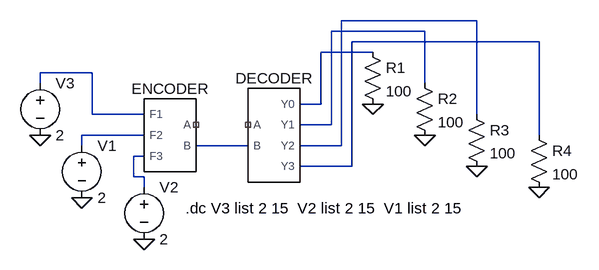
[diagram p0: schematic EXP5-2_UtsavPathak.asc]
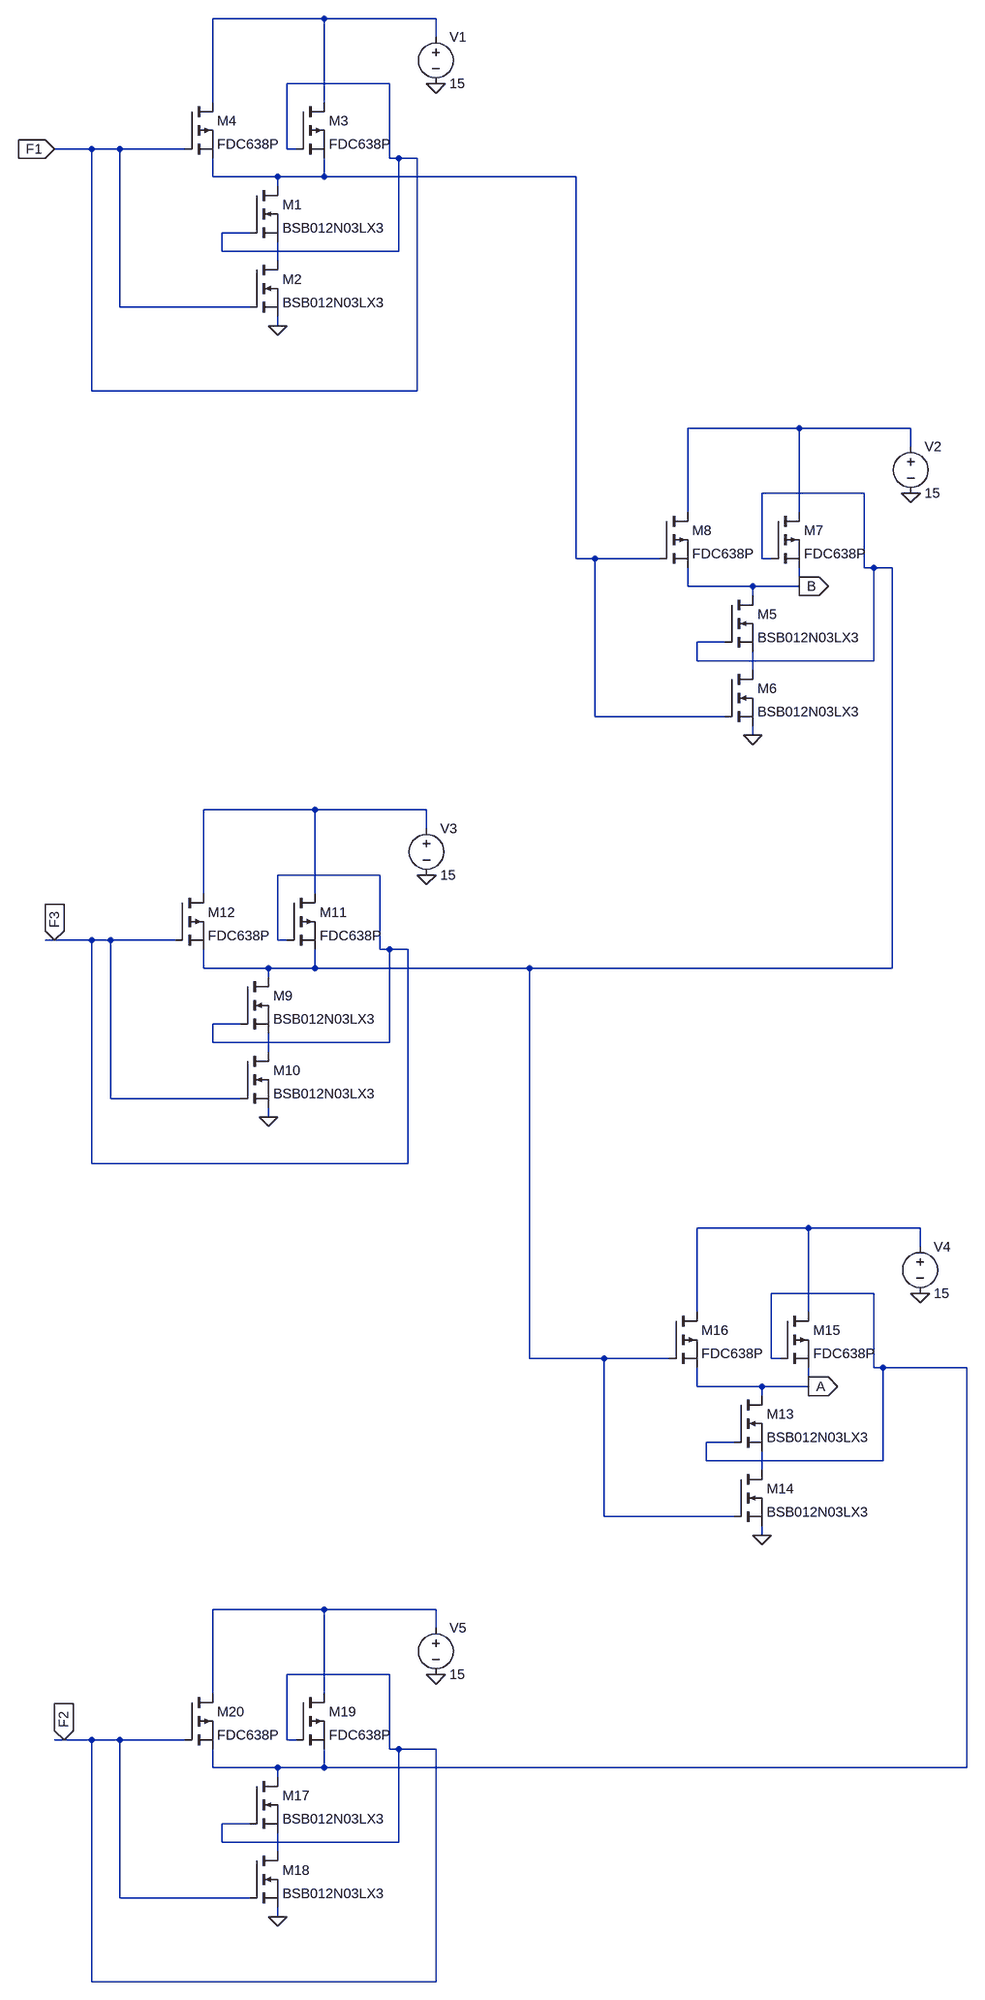
[diagram p1: sub-circuit encoder_exp5.asc]
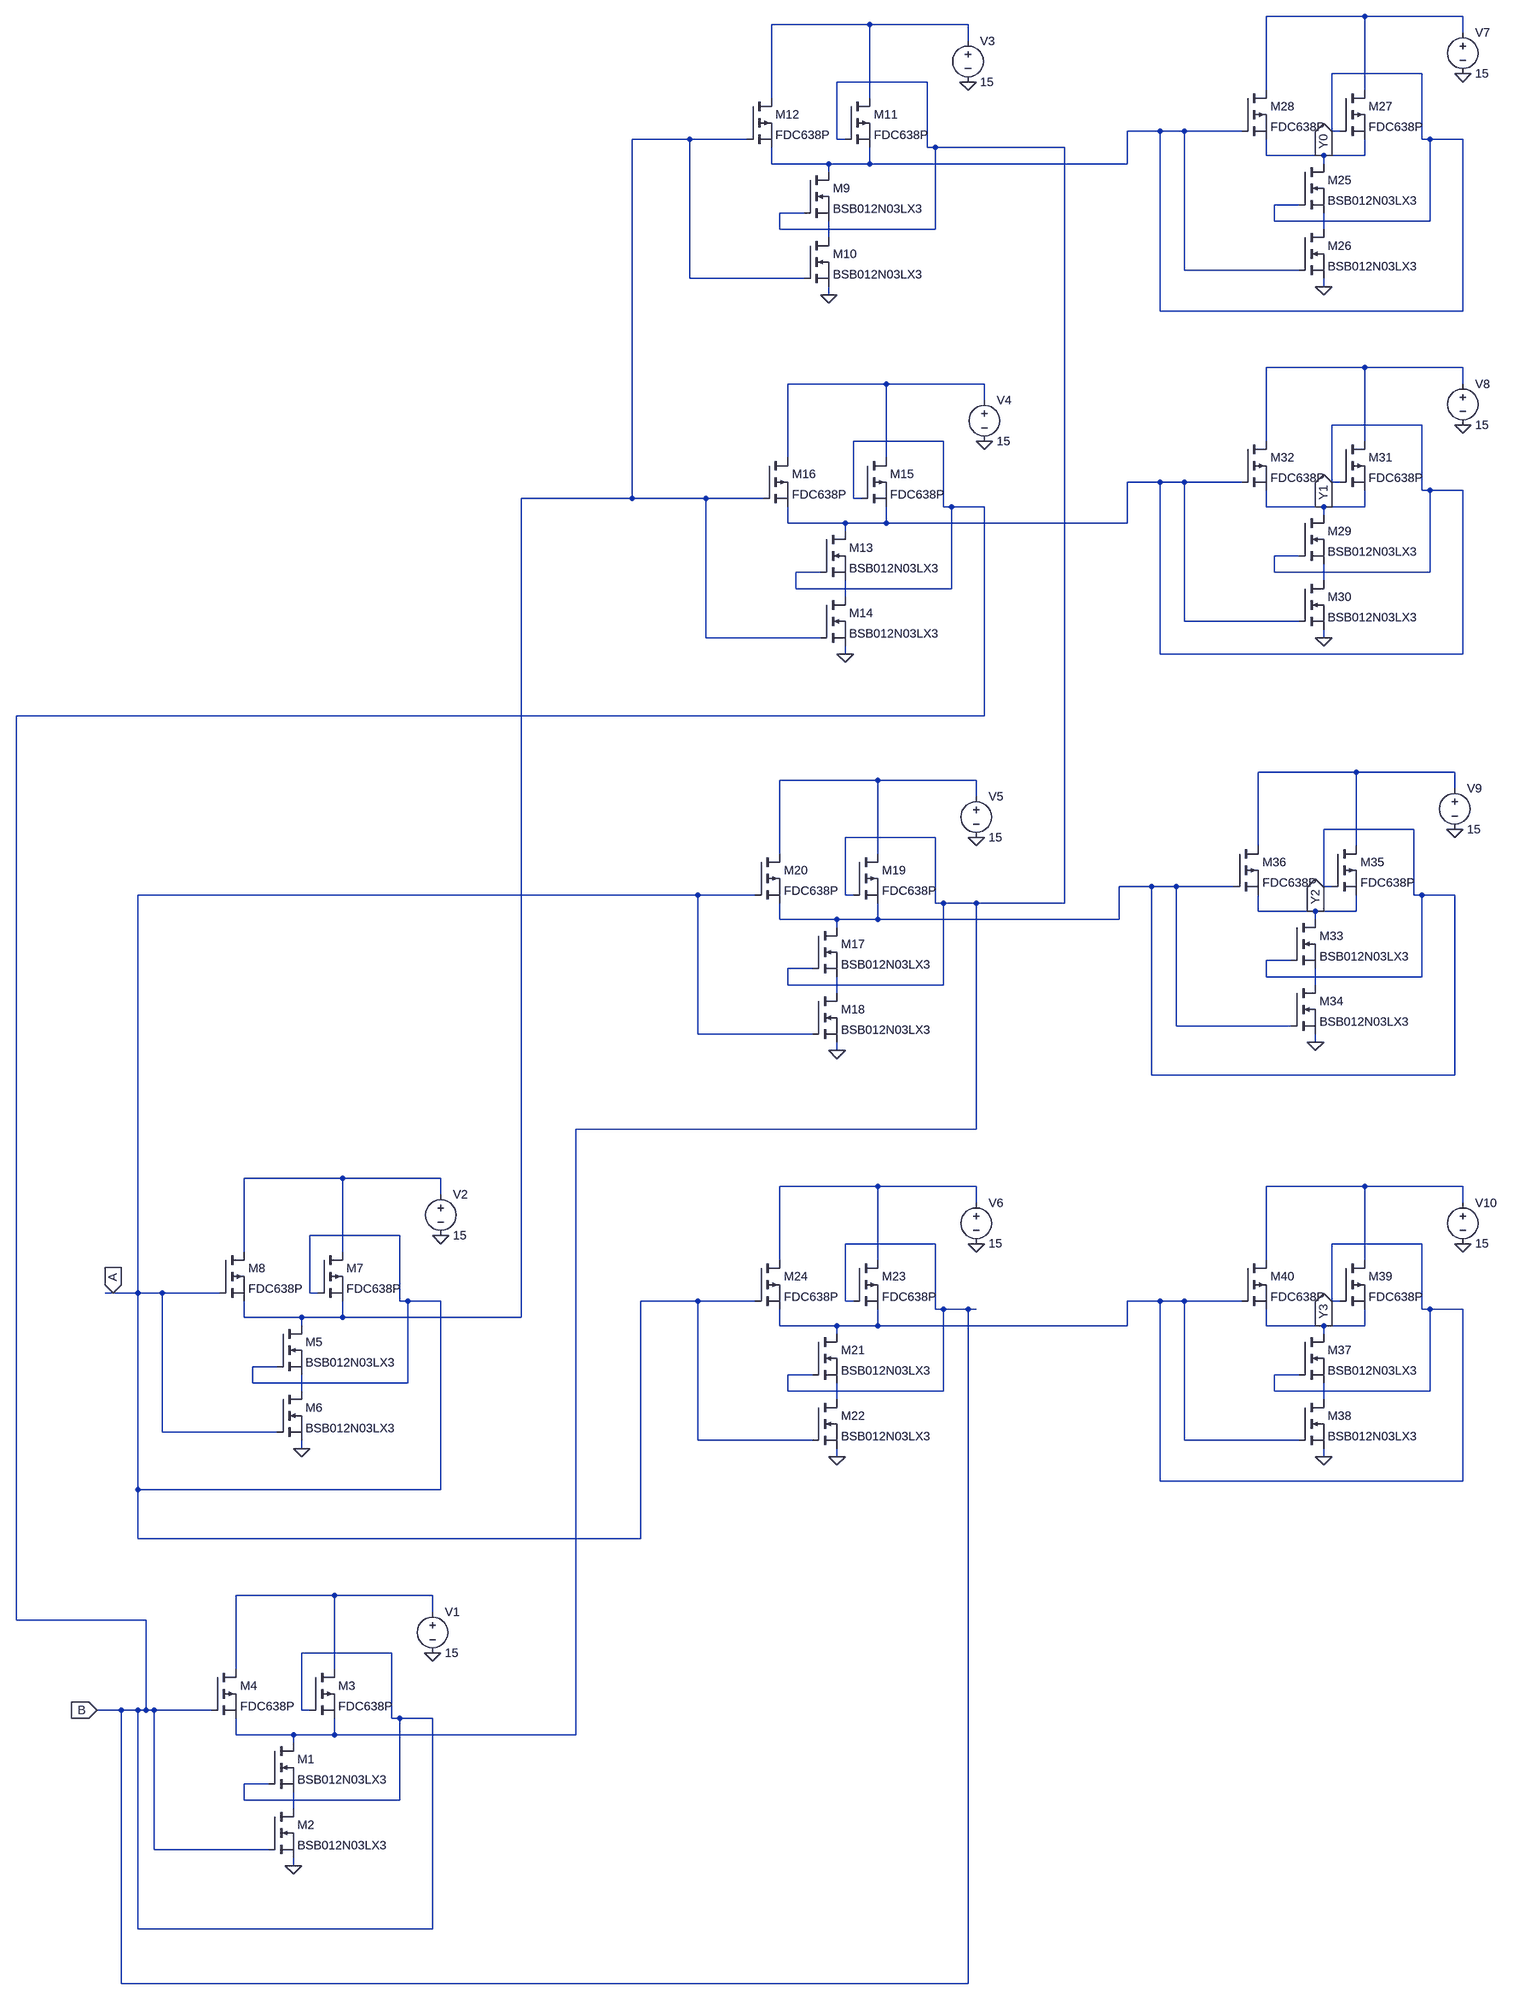
[diagram p2: sub-circuit decoder_exp5.asc]
EXP5-2_UtsavPathak.asc, the LTspice schematic file:
Version 4
SHEET 1 880 680
WIRE 544 -32 336 -32
WIRE 464 -16 320 -16
WIRE 640 0 352 0
WIRE 384 16 304 16
WIRE -48 48 -128 48
WIRE -128 64 -128 48
WIRE 464 64 464 -16
WIRE 304 96 304 16
WIRE 304 96 272 96
WIRE -48 112 -48 48
WIRE 32 112 -48 112
WIRE 544 112 544 -32
WIRE 320 128 320 -16
WIRE 320 128 272 128
WIRE 32 144 -64 144
WIRE 640 144 640 0
WIRE -64 160 -64 144
WIRE 192 160 112 160
WIRE 336 160 336 -32
WIRE 336 160 272 160
WIRE 32 176 16 176
WIRE 352 192 352 0
WIRE 352 192 272 192
WIRE 16 208 16 176
WIRE 32 208 16 208
WIRE 32 224 32 208
FLAG -128 144 0
FLAG -64 240 0
FLAG 32 304 0
FLAG 384 96 0
FLAG 464 144 0
FLAG 544 192 0
FLAG 640 224 0
SYMBOL ENCODER_EXP5 64 144 R0
SYMATTR InstName ENCODER
SYMBOL DECODER_EXP5 224 144 R0
SYMATTR InstName DECODER
SYMBOL voltage -128 48 R0
SYMATTR InstName V3
SYMATTR Value 2
SYMBOL voltage -64 144 R0
WINDOW 123 0 0 Left 0
WINDOW 39 0 0 Left 0
SYMATTR InstName V1
SYMATTR Value 2
SYMBOL voltage 32 208 R0
SYMATTR InstName V2
SYMATTR Value 2
SYMBOL res 368 0 R0
SYMATTR InstName R1
SYMATTR Value 100
SYMBOL res 448 48 R0
SYMATTR InstName R2
SYMATTR Value 100
SYMBOL res 528 96 R0
SYMATTR InstName R3
SYMATTR Value 100
SYMBOL res 624 128 R0
SYMATTR InstName R4
SYMATTR Value 100
TEXT 96 256 Left 2 !.dc V3 list 2 15  V2 list 2 15  V1 list 2 15

encoder_exp5.asc, the sub-circuit schematic file:
Version 4
SHEET 1 1188 2036
WIRE 32 -1888 -160 -1888
WIRE 224 -1888 32 -1888
WIRE 224 -1856 224 -1888
WIRE 144 -1776 -32 -1776
WIRE -160 -1744 -160 -1888
WIRE 32 -1744 32 -1888
WIRE -368 -1664 -432 -1664
WIRE -320 -1664 -368 -1664
WIRE -208 -1664 -320 -1664
WIRE -32 -1664 -32 -1776
WIRE -16 -1664 -32 -1664
WIRE 144 -1648 144 -1776
WIRE 160 -1648 144 -1648
WIRE 192 -1648 160 -1648
WIRE -160 -1616 -160 -1648
WIRE -48 -1616 -160 -1616
WIRE 32 -1616 32 -1648
WIRE 32 -1616 -48 -1616
WIRE 512 -1616 32 -1616
WIRE -48 -1600 -48 -1616
WIRE -96 -1520 -144 -1520
WIRE -144 -1488 -144 -1520
WIRE 160 -1488 160 -1648
WIRE 160 -1488 -144 -1488
WIRE -48 -1472 -48 -1504
WIRE -320 -1392 -320 -1664
WIRE -96 -1392 -320 -1392
WIRE -48 -1360 -48 -1376
WIRE -368 -1248 -368 -1664
WIRE 192 -1248 192 -1648
WIRE 192 -1248 -368 -1248
WIRE 896 -1184 704 -1184
WIRE 1088 -1184 896 -1184
WIRE 1088 -1152 1088 -1184
WIRE 1008 -1072 832 -1072
WIRE 704 -1040 704 -1184
WIRE 896 -1040 896 -1184
WIRE 512 -960 512 -1616
WIRE 544 -960 512 -960
WIRE 656 -960 544 -960
WIRE 832 -960 832 -1072
WIRE 848 -960 832 -960
WIRE 1008 -944 1008 -1072
WIRE 1024 -944 1008 -944
WIRE 1056 -944 1024 -944
WIRE 704 -912 704 -944
WIRE 816 -912 704 -912
WIRE 896 -912 896 -944
WIRE 896 -912 816 -912
WIRE 816 -896 816 -912
WIRE 768 -816 720 -816
WIRE 720 -784 720 -816
WIRE 1024 -784 1024 -944
WIRE 1024 -784 720 -784
WIRE 816 -768 816 -800
WIRE 544 -688 544 -960
WIRE 768 -688 544 -688
WIRE 816 -656 816 -672
WIRE 16 -336 -176 -336
WIRE 208 -336 16 -336
WIRE 208 -304 208 -336
WIRE 128 -224 -48 -224
WIRE -176 -192 -176 -336
WIRE 16 -192 16 -336
WIRE -432 -112 -448 -112
WIRE -368 -112 -432 -112
WIRE -336 -112 -368 -112
WIRE -224 -112 -336 -112
WIRE -48 -112 -48 -224
WIRE -32 -112 -48 -112
WIRE 128 -96 128 -224
WIRE 144 -96 128 -96
WIRE 176 -96 144 -96
WIRE -176 -64 -176 -96
WIRE -64 -64 -176 -64
WIRE 16 -64 16 -96
WIRE 16 -64 -64 -64
WIRE 432 -64 16 -64
WIRE 1056 -64 1056 -944
WIRE 1056 -64 432 -64
WIRE -64 -48 -64 -64
WIRE -112 32 -160 32
WIRE -160 64 -160 32
WIRE 144 64 144 -96
WIRE 144 64 -160 64
WIRE -64 80 -64 48
WIRE -336 160 -336 -112
WIRE -112 160 -336 160
WIRE -64 192 -64 176
WIRE -368 272 -368 -112
WIRE 176 272 176 -96
WIRE 176 272 -368 272
WIRE 912 528 720 528
WIRE 1104 528 912 528
WIRE 1104 560 1104 528
WIRE 1024 640 848 640
WIRE 720 672 720 528
WIRE 912 672 912 528
WIRE 432 752 432 -64
WIRE 560 752 432 752
WIRE 672 752 560 752
WIRE 848 752 848 640
WIRE 864 752 848 752
WIRE 1024 768 1024 640
WIRE 1040 768 1024 768
WIRE 1184 768 1040 768
WIRE 720 800 720 768
WIRE 832 800 720 800
WIRE 912 800 912 768
WIRE 912 800 832 800
WIRE 832 816 832 800
WIRE 784 896 736 896
WIRE 736 928 736 896
WIRE 1040 928 1040 768
WIRE 1040 928 736 928
WIRE 832 944 832 912
WIRE 560 1024 560 752
WIRE 784 1024 560 1024
WIRE 832 1056 832 1040
WIRE 32 1392 -160 1392
WIRE 224 1392 32 1392
WIRE 224 1424 224 1392
WIRE 144 1504 -32 1504
WIRE -160 1536 -160 1392
WIRE 32 1536 32 1392
WIRE -416 1616 -432 1616
WIRE -368 1616 -416 1616
WIRE -320 1616 -368 1616
WIRE -208 1616 -320 1616
WIRE -32 1616 -32 1504
WIRE -16 1616 -32 1616
WIRE 144 1632 144 1504
WIRE 160 1632 144 1632
WIRE 224 1632 160 1632
WIRE -160 1664 -160 1632
WIRE -48 1664 -160 1664
WIRE 32 1664 32 1632
WIRE 32 1664 -48 1664
WIRE 1184 1664 1184 768
WIRE 1184 1664 32 1664
WIRE -48 1680 -48 1664
WIRE -96 1760 -144 1760
WIRE -144 1792 -144 1760
WIRE 160 1792 160 1632
WIRE 160 1792 -144 1792
WIRE -48 1808 -48 1776
WIRE -320 1888 -320 1616
WIRE -96 1888 -320 1888
WIRE -48 1920 -48 1904
WIRE -368 2032 -368 1616
WIRE 224 2032 224 1632
WIRE 224 2032 -368 2032
FLAG 224 -1776 0
FLAG -48 -1360 0
FLAG 1088 -1072 0
FLAG 816 -656 0
FLAG 208 -224 0
FLAG -64 192 0
FLAG 1104 640 0
FLAG 832 1056 0
FLAG 224 1504 0
FLAG -48 1920 0
FLAG -432 -1664 F1
IOPIN -432 -1664 In
FLAG -432 -112 F3
IOPIN -432 -112 In
FLAG -416 1616 F2
IOPIN -416 1616 In
FLAG 896 -912 B
IOPIN 896 -912 Out
FLAG 912 800 A
IOPIN 912 800 Out
SYMBOL nmos -96 -1600 R0
SYMATTR InstName M1
SYMATTR Value BSB012N03LX3
SYMBOL nmos -96 -1472 R0
SYMATTR InstName M2
SYMATTR Value BSB012N03LX3
SYMBOL pmos -16 -1744 R0
SYMATTR InstName M3
SYMATTR Value FDC638P
SYMBOL pmos -208 -1744 R0
SYMATTR InstName M4
SYMATTR Value FDC638P
SYMBOL voltage 224 -1872 R0
SYMATTR InstName V1
SYMATTR Value 15
SYMBOL nmos 768 -896 R0
SYMATTR InstName M5
SYMATTR Value BSB012N03LX3
SYMBOL nmos 768 -768 R0
SYMATTR InstName M6
SYMATTR Value BSB012N03LX3
SYMBOL pmos 848 -1040 R0
SYMATTR InstName M7
SYMATTR Value FDC638P
SYMBOL pmos 656 -1040 R0
SYMATTR InstName M8
SYMATTR Value FDC638P
SYMBOL voltage 1088 -1168 R0
SYMATTR InstName V2
SYMATTR Value 15
SYMBOL nmos -112 -48 R0
SYMATTR InstName M9
SYMATTR Value BSB012N03LX3
SYMBOL nmos -112 80 R0
SYMATTR InstName M10
SYMATTR Value BSB012N03LX3
SYMBOL pmos -32 -192 R0
SYMATTR InstName M11
SYMATTR Value FDC638P
SYMBOL pmos -224 -192 R0
SYMATTR InstName M12
SYMATTR Value FDC638P
SYMBOL voltage 208 -320 R0
SYMATTR InstName V3
SYMATTR Value 15
SYMBOL nmos 784 816 R0
SYMATTR InstName M13
SYMATTR Value BSB012N03LX3
SYMBOL nmos 784 944 R0
SYMATTR InstName M14
SYMATTR Value BSB012N03LX3
SYMBOL pmos 864 672 R0
SYMATTR InstName M15
SYMATTR Value FDC638P
SYMBOL pmos 672 672 R0
SYMATTR InstName M16
SYMATTR Value FDC638P
SYMBOL voltage 1104 544 R0
SYMATTR InstName V4
SYMATTR Value 15
SYMBOL nmos -96 1680 R0
SYMATTR InstName M17
SYMATTR Value BSB012N03LX3
SYMBOL nmos -96 1808 R0
SYMATTR InstName M18
SYMATTR Value BSB012N03LX3
SYMBOL pmos -16 1536 R0
SYMATTR InstName M19
SYMATTR Value FDC638P
SYMBOL pmos -208 1536 R0
SYMATTR InstName M20
SYMATTR Value FDC638P
SYMBOL voltage 224 1408 R0
SYMATTR InstName V5
SYMATTR Value 15

decoder_exp5.asc, the sub-circuit schematic file:
Version 4
SHEET 1 1944 2772
WIRE 1680 -2064 1488 -2064
WIRE 1872 -2064 1680 -2064
WIRE 448 -2048 256 -2048
WIRE 640 -2048 448 -2048
WIRE 1872 -2032 1872 -2064
WIRE 640 -2016 640 -2048
WIRE 1792 -1952 1616 -1952
WIRE 560 -1936 384 -1936
WIRE 1488 -1920 1488 -2064
WIRE 1680 -1920 1680 -2064
WIRE 256 -1904 256 -2048
WIRE 448 -1904 448 -2048
WIRE 1280 -1840 1216 -1840
WIRE 1328 -1840 1280 -1840
WIRE 1440 -1840 1328 -1840
WIRE 1616 -1840 1616 -1952
WIRE 1632 -1840 1616 -1840
WIRE 96 -1824 -16 -1824
WIRE 208 -1824 96 -1824
WIRE 384 -1824 384 -1936
WIRE 400 -1824 384 -1824
WIRE 1792 -1824 1792 -1952
WIRE 1808 -1824 1792 -1824
WIRE 1872 -1824 1808 -1824
WIRE 560 -1808 560 -1936
WIRE 576 -1808 560 -1808
WIRE 880 -1808 576 -1808
WIRE 1488 -1792 1488 -1824
WIRE 1600 -1792 1488 -1792
WIRE 1680 -1792 1680 -1824
WIRE 1680 -1792 1600 -1792
WIRE 256 -1776 256 -1808
WIRE 368 -1776 256 -1776
WIRE 448 -1776 448 -1808
WIRE 448 -1776 368 -1776
WIRE 1216 -1776 1216 -1840
WIRE 1216 -1776 448 -1776
WIRE 1600 -1776 1600 -1792
WIRE 368 -1760 368 -1776
WIRE 1552 -1696 1504 -1696
WIRE 320 -1680 272 -1680
WIRE 1504 -1664 1504 -1696
WIRE 1808 -1664 1808 -1824
WIRE 1808 -1664 1504 -1664
WIRE 272 -1648 272 -1680
WIRE 576 -1648 576 -1808
WIRE 576 -1648 272 -1648
WIRE 1600 -1648 1600 -1680
WIRE 368 -1632 368 -1664
WIRE 1328 -1568 1328 -1840
WIRE 1552 -1568 1328 -1568
WIRE 96 -1552 96 -1824
WIRE 320 -1552 96 -1552
WIRE 1600 -1536 1600 -1552
WIRE 368 -1520 368 -1536
WIRE 1280 -1488 1280 -1840
WIRE 1872 -1488 1872 -1824
WIRE 1872 -1488 1280 -1488
WIRE 1680 -1168 1488 -1168
WIRE 1872 -1168 1680 -1168
WIRE 480 -1136 288 -1136
WIRE 672 -1136 480 -1136
WIRE 1872 -1136 1872 -1168
WIRE 672 -1104 672 -1136
WIRE 1792 -1056 1616 -1056
WIRE 592 -1024 416 -1024
WIRE 1488 -1024 1488 -1168
WIRE 1680 -1024 1680 -1168
WIRE 288 -992 288 -1136
WIRE 480 -992 480 -1136
WIRE 1280 -944 1216 -944
WIRE 1328 -944 1280 -944
WIRE 1440 -944 1328 -944
WIRE 1616 -944 1616 -1056
WIRE 1632 -944 1616 -944
WIRE 1792 -928 1792 -1056
WIRE 1808 -928 1792 -928
WIRE 1872 -928 1808 -928
WIRE -16 -912 -16 -1824
WIRE -16 -912 -608 -912
WIRE 128 -912 -16 -912
WIRE 240 -912 128 -912
WIRE 416 -912 416 -1024
WIRE 432 -912 416 -912
WIRE 592 -896 592 -1024
WIRE 608 -896 592 -896
WIRE 672 -896 608 -896
WIRE 1488 -896 1488 -928
WIRE 1600 -896 1488 -896
WIRE 1680 -896 1680 -928
WIRE 1680 -896 1600 -896
WIRE 1600 -880 1600 -896
WIRE 288 -864 288 -896
WIRE 400 -864 288 -864
WIRE 480 -864 480 -896
WIRE 480 -864 400 -864
WIRE 1216 -864 1216 -944
WIRE 1216 -864 480 -864
WIRE 400 -848 400 -864
WIRE 1552 -800 1504 -800
WIRE 352 -768 304 -768
WIRE 1504 -768 1504 -800
WIRE 1808 -768 1808 -928
WIRE 1808 -768 1504 -768
WIRE 1600 -752 1600 -784
WIRE 304 -736 304 -768
WIRE 608 -736 608 -896
WIRE 608 -736 304 -736
WIRE 400 -720 400 -752
WIRE 1328 -672 1328 -944
WIRE 1552 -672 1328 -672
WIRE 128 -640 128 -912
WIRE 352 -640 128 -640
WIRE 1600 -640 1600 -656
WIRE 400 -608 400 -624
WIRE 1280 -608 1280 -944
WIRE 1872 -608 1872 -928
WIRE 1872 -608 1280 -608
WIRE 672 -272 672 -896
WIRE 672 -272 -2048 -272
WIRE 1664 -96 1472 -96
WIRE 1856 -96 1664 -96
WIRE 464 -80 272 -80
WIRE 656 -80 464 -80
WIRE 1856 -64 1856 -96
WIRE 656 -48 656 -80
WIRE 1776 16 1600 16
WIRE 576 32 400 32
WIRE 1472 48 1472 -96
WIRE 1664 48 1664 -96
WIRE 272 64 272 -80
WIRE 464 64 464 -80
WIRE 1264 128 1200 128
WIRE 1312 128 1264 128
WIRE 1424 128 1312 128
WIRE 1600 128 1600 16
WIRE 1616 128 1600 128
WIRE 112 144 -1584 144
WIRE 224 144 112 144
WIRE 400 144 400 32
WIRE 416 144 400 144
WIRE 1776 144 1776 16
WIRE 1792 144 1776 144
WIRE 1856 144 1792 144
WIRE 576 160 576 32
WIRE 592 160 576 160
WIRE 656 160 592 160
WIRE 880 160 880 -1808
WIRE 880 160 656 160
WIRE 1472 176 1472 144
WIRE 1584 176 1472 176
WIRE 1664 176 1664 144
WIRE 1664 176 1584 176
WIRE 272 192 272 160
WIRE 384 192 272 192
WIRE 464 192 464 160
WIRE 464 192 384 192
WIRE 1200 192 1200 128
WIRE 1200 192 464 192
WIRE 1584 192 1584 176
WIRE 384 208 384 192
WIRE 1536 272 1488 272
WIRE 336 288 288 288
WIRE 1488 304 1488 272
WIRE 1792 304 1792 144
WIRE 1792 304 1488 304
WIRE 288 320 288 288
WIRE 592 320 592 160
WIRE 592 320 288 320
WIRE 1584 320 1584 288
WIRE 384 336 384 304
WIRE 1312 400 1312 128
WIRE 1536 400 1312 400
WIRE 112 416 112 144
WIRE 336 416 112 416
WIRE 1584 432 1584 416
WIRE 384 448 384 432
WIRE 1264 496 1264 128
WIRE 1856 496 1856 144
WIRE 1856 496 1264 496
WIRE 656 800 656 160
WIRE 656 800 -416 800
WIRE -1184 896 -1376 896
WIRE -992 896 -1184 896
WIRE 464 912 272 912
WIRE 656 912 464 912
WIRE 1680 912 1488 912
WIRE 1872 912 1680 912
WIRE -992 928 -992 896
WIRE 656 944 656 912
WIRE 1872 944 1872 912
WIRE -1072 1008 -1248 1008
WIRE 576 1024 400 1024
WIRE 1792 1024 1616 1024
WIRE -1376 1040 -1376 896
WIRE -1184 1040 -1184 896
WIRE 272 1056 272 912
WIRE 464 1056 464 912
WIRE 1488 1056 1488 912
WIRE 1680 1056 1680 912
WIRE -1632 1120 -1648 1120
WIRE -1584 1120 -1584 144
WIRE -1584 1120 -1632 1120
WIRE -1536 1120 -1584 1120
WIRE -1424 1120 -1536 1120
WIRE -1248 1120 -1248 1008
WIRE -1232 1120 -1248 1120
WIRE -1072 1136 -1072 1008
WIRE -1056 1136 -1072 1136
WIRE -992 1136 -1056 1136
WIRE 112 1136 0 1136
WIRE 224 1136 112 1136
WIRE 400 1136 400 1024
WIRE 416 1136 400 1136
WIRE 1280 1136 1216 1136
WIRE 1328 1136 1280 1136
WIRE 1440 1136 1328 1136
WIRE 1616 1136 1616 1024
WIRE 1632 1136 1616 1136
WIRE 576 1152 576 1024
WIRE 592 1152 576 1152
WIRE 640 1152 592 1152
WIRE 656 1152 640 1152
WIRE 1792 1152 1792 1024
WIRE 1808 1152 1792 1152
WIRE 1872 1152 1808 1152
WIRE -1376 1168 -1376 1136
WIRE -1264 1168 -1376 1168
WIRE -1184 1168 -1184 1136
WIRE -1184 1168 -1264 1168
WIRE -608 1168 -608 -912
WIRE -608 1168 -1184 1168
WIRE -1264 1184 -1264 1168
WIRE 272 1184 272 1152
WIRE 384 1184 272 1184
WIRE 464 1184 464 1152
WIRE 464 1184 384 1184
WIRE 1216 1184 1216 1136
WIRE 1216 1184 464 1184
WIRE 1488 1184 1488 1152
WIRE 1600 1184 1488 1184
WIRE 1680 1184 1680 1152
WIRE 1680 1184 1600 1184
WIRE 384 1200 384 1184
WIRE 1600 1200 1600 1184
WIRE -1312 1264 -1360 1264
WIRE 336 1280 288 1280
WIRE 1552 1280 1504 1280
WIRE -1360 1296 -1360 1264
WIRE -1056 1296 -1056 1136
WIRE -1056 1296 -1360 1296
WIRE -1264 1312 -1264 1280
WIRE 288 1312 288 1280
WIRE 592 1312 592 1152
WIRE 592 1312 288 1312
WIRE 1504 1312 1504 1280
WIRE 1808 1312 1808 1152
WIRE 1808 1312 1504 1312
WIRE 384 1328 384 1296
WIRE 1600 1328 1600 1296
WIRE -1536 1392 -1536 1120
WIRE -1312 1392 -1536 1392
WIRE 112 1408 112 1136
WIRE 336 1408 112 1408
WIRE 1328 1408 1328 1136
WIRE 1552 1408 1328 1408
WIRE -1264 1424 -1264 1408
WIRE 384 1440 384 1424
WIRE 1600 1440 1600 1424
WIRE 1280 1488 1280 1136
WIRE 1872 1488 1872 1152
WIRE 1872 1488 1280 1488
WIRE -1584 1504 -1584 1120
WIRE -992 1504 -992 1136
WIRE -992 1504 -1584 1504
WIRE -1584 1600 -1584 1504
WIRE 0 1600 0 1136
WIRE 0 1600 -1584 1600
WIRE -1200 1968 -1392 1968
WIRE -1008 1968 -1200 1968
WIRE -1008 2000 -1008 1968
WIRE -2048 2016 -2048 -272
WIRE -1568 2016 -2048 2016
WIRE -1088 2080 -1264 2080
WIRE -1392 2112 -1392 1968
WIRE -1200 2112 -1200 1968
WIRE -1616 2192 -1664 2192
WIRE -1584 2192 -1616 2192
WIRE -1568 2192 -1568 2016
WIRE -1568 2192 -1584 2192
WIRE -1552 2192 -1568 2192
WIRE -1440 2192 -1552 2192
WIRE -1264 2192 -1264 2080
WIRE -1248 2192 -1264 2192
WIRE -1088 2208 -1088 2080
WIRE -1072 2208 -1088 2208
WIRE -1008 2208 -1072 2208
WIRE -1392 2240 -1392 2208
WIRE -1280 2240 -1392 2240
WIRE -1200 2240 -1200 2208
WIRE -1200 2240 -1280 2240
WIRE -416 2240 -416 800
WIRE -416 2240 -1200 2240
WIRE -1280 2256 -1280 2240
WIRE -1328 2336 -1376 2336
WIRE -1376 2368 -1376 2336
WIRE -1072 2368 -1072 2208
WIRE -1072 2368 -1376 2368
WIRE -1280 2384 -1280 2352
WIRE -1552 2464 -1552 2192
WIRE -1328 2464 -1552 2464
WIRE -1280 2496 -1280 2480
WIRE -1584 2624 -1584 2192
WIRE -1008 2624 -1008 2208
WIRE -1008 2624 -1584 2624
WIRE -1616 2768 -1616 2192
WIRE 640 2768 640 1152
WIRE 640 2768 -1616 2768
FLAG -1008 2080 0
FLAG -1280 2496 0
FLAG -992 1008 0
FLAG -1264 1424 0
FLAG 640 -1936 0
FLAG 368 -1520 0
FLAG 672 -1024 0
FLAG 400 -608 0
FLAG 656 32 0
FLAG 384 448 0
FLAG 656 1024 0
FLAG 384 1440 0
FLAG 1872 -1952 0
FLAG 1600 -1536 0
FLAG 1872 -1056 0
FLAG 1600 -640 0
FLAG 1856 16 0
FLAG 1584 432 0
FLAG 1872 1024 0
FLAG 1600 1440 0
FLAG 1600 -1792 Y0
IOPIN 1600 -1792 Out
FLAG 1600 -896 Y1
IOPIN 1600 -896 Out
FLAG 1584 176 Y2
IOPIN 1584 176 Out
FLAG 1600 1184 Y3
IOPIN 1600 1184 Out
FLAG -1632 1120 A
IOPIN -1632 1120 In
FLAG -1664 2192 B
IOPIN -1664 2192 In
SYMBOL nmos -1328 2256 R0
SYMATTR InstName M1
SYMATTR Value BSB012N03LX3
SYMBOL nmos -1328 2384 R0
SYMATTR InstName M2
SYMATTR Value BSB012N03LX3
SYMBOL pmos -1248 2112 R0
SYMATTR InstName M3
SYMATTR Value FDC638P
SYMBOL pmos -1440 2112 R0
SYMATTR InstName M4
SYMATTR Value FDC638P
SYMBOL voltage -1008 1984 R0
SYMATTR InstName V1
SYMATTR Value 15
SYMBOL nmos -1312 1184 R0
SYMATTR InstName M5
SYMATTR Value BSB012N03LX3
SYMBOL nmos -1312 1312 R0
SYMATTR InstName M6
SYMATTR Value BSB012N03LX3
SYMBOL pmos -1232 1040 R0
SYMATTR InstName M7
SYMATTR Value FDC638P
SYMBOL pmos -1424 1040 R0
SYMATTR InstName M8
SYMATTR Value FDC638P
SYMBOL voltage -992 912 R0
SYMATTR InstName V2
SYMATTR Value 15
SYMBOL nmos 320 -1760 R0
SYMATTR InstName M9
SYMATTR Value BSB012N03LX3
SYMBOL nmos 320 -1632 R0
SYMATTR InstName M10
SYMATTR Value BSB012N03LX3
SYMBOL pmos 400 -1904 R0
SYMATTR InstName M11
SYMATTR Value FDC638P
SYMBOL pmos 208 -1904 R0
SYMATTR InstName M12
SYMATTR Value FDC638P
SYMBOL voltage 640 -2032 R0
SYMATTR InstName V3
SYMATTR Value 15
SYMBOL nmos 352 -848 R0
SYMATTR InstName M13
SYMATTR Value BSB012N03LX3
SYMBOL nmos 352 -720 R0
SYMATTR InstName M14
SYMATTR Value BSB012N03LX3
SYMBOL pmos 432 -992 R0
SYMATTR InstName M15
SYMATTR Value FDC638P
SYMBOL pmos 240 -992 R0
SYMATTR InstName M16
SYMATTR Value FDC638P
SYMBOL voltage 672 -1120 R0
SYMATTR InstName V4
SYMATTR Value 15
SYMBOL nmos 336 208 R0
SYMATTR InstName M17
SYMATTR Value BSB012N03LX3
SYMBOL nmos 336 336 R0
SYMATTR InstName M18
SYMATTR Value BSB012N03LX3
SYMBOL pmos 416 64 R0
SYMATTR InstName M19
SYMATTR Value FDC638P
SYMBOL pmos 224 64 R0
SYMATTR InstName M20
SYMATTR Value FDC638P
SYMBOL voltage 656 -64 R0
SYMATTR InstName V5
SYMATTR Value 15
SYMBOL nmos 336 1200 R0
SYMATTR InstName M21
SYMATTR Value BSB012N03LX3
SYMBOL nmos 336 1328 R0
SYMATTR InstName M22
SYMATTR Value BSB012N03LX3
SYMBOL pmos 416 1056 R0
SYMATTR InstName M23
SYMATTR Value FDC638P
SYMBOL pmos 224 1056 R0
SYMATTR InstName M24
SYMATTR Value FDC638P
SYMBOL voltage 656 928 R0
SYMATTR InstName V6
SYMATTR Value 15
SYMBOL nmos 1552 -1776 R0
SYMATTR InstName M25
SYMATTR Value BSB012N03LX3
SYMBOL nmos 1552 -1648 R0
SYMATTR InstName M26
SYMATTR Value BSB012N03LX3
SYMBOL pmos 1632 -1920 R0
SYMATTR InstName M27
SYMATTR Value FDC638P
SYMBOL pmos 1440 -1920 R0
SYMATTR InstName M28
SYMATTR Value FDC638P
SYMBOL voltage 1872 -2048 R0
SYMATTR InstName V7
SYMATTR Value 15
SYMBOL nmos 1552 -880 R0
SYMATTR InstName M29
SYMATTR Value BSB012N03LX3
SYMBOL nmos 1552 -752 R0
SYMATTR InstName M30
SYMATTR Value BSB012N03LX3
SYMBOL pmos 1632 -1024 R0
SYMATTR InstName M31
SYMATTR Value FDC638P
SYMBOL pmos 1440 -1024 R0
SYMATTR InstName M32
SYMATTR Value FDC638P
SYMBOL voltage 1872 -1152 R0
SYMATTR InstName V8
SYMATTR Value 15
SYMBOL nmos 1536 192 R0
SYMATTR InstName M33
SYMATTR Value BSB012N03LX3
SYMBOL nmos 1536 320 R0
SYMATTR InstName M34
SYMATTR Value BSB012N03LX3
SYMBOL pmos 1616 48 R0
SYMATTR InstName M35
SYMATTR Value FDC638P
SYMBOL pmos 1424 48 R0
SYMATTR InstName M36
SYMATTR Value FDC638P
SYMBOL voltage 1856 -80 R0
SYMATTR InstName V9
SYMATTR Value 15
SYMBOL nmos 1552 1200 R0
SYMATTR InstName M37
SYMATTR Value BSB012N03LX3
SYMBOL nmos 1552 1328 R0
SYMATTR InstName M38
SYMATTR Value BSB012N03LX3
SYMBOL pmos 1632 1056 R0
SYMATTR InstName M39
SYMATTR Value FDC638P
SYMBOL pmos 1440 1056 R0
SYMATTR InstName M40
SYMATTR Value FDC638P
SYMBOL voltage 1872 928 R0
SYMATTR InstName V10
SYMATTR Value 15

The netlist it stands for:
* EXP5-2_UtsavPathak.asc
XENCODER N005 N006 N008 NC_01 N007 encoder_exp5
XDECODER NC_02 N007 N004 N002 N001 N003 decoder_exp5
V3 N005 0 2
V1 N006 0 2
V2 N008 0 2
R1 N004 0 100
R2 N002 0 100
R3 N001 0 100
R4 N003 0 100

* block symbol definitions
.subckt encoder_exp5 F1 F2 F3 A B
M1 N002 F1 N003 N003 BSB012N03LX3
M2 N003 F1 0 0 BSB012N03LX3
M3 N001 F1 N002 N002 FDC638P
M4 N001 F1 N002 N002 FDC638P
V1 N001 0 15
M5 B N005 N006 N006 BSB012N03LX3
M6 N006 N002 0 0 BSB012N03LX3
M7 N004 N005 B B FDC638P
M8 N004 N002 B B FDC638P
V2 N004 0 15
M9 N005 F3 N008 N008 BSB012N03LX3
M10 N008 F3 0 0 BSB012N03LX3
M11 N007 F3 N005 N005 FDC638P
M12 N007 F3 N005 N005 FDC638P
V3 N007 0 15
M13 A N010 N011 N011 BSB012N03LX3
M14 N011 N005 0 0 BSB012N03LX3
M15 N009 N010 A A FDC638P
M16 N009 N005 A A FDC638P
V4 N009 0 15
M17 N010 F2 N013 N013 BSB012N03LX3
M18 N013 F2 0 0 BSB012N03LX3
M19 N012 F2 N010 N010 FDC638P
M20 N012 F2 N010 N010 FDC638P
V5 N012 0 15
.ends encoder_exp5

.subckt decoder_exp5 A B Y0 Y1 Y2 Y3
M1 N004 B N026 N026 BSB012N03LX3
M2 N026 B 0 0 BSB012N03LX3
M3 N025 B N004 N004 FDC638P
M4 N025 B N004 N004 FDC638P
V1 N025 0 15
M5 N005 A N022 N022 BSB012N03LX3
M6 N022 A 0 0 BSB012N03LX3
M7 N018 A N005 N005 FDC638P
M8 N018 A N005 N005 FDC638P
V2 N018 0 15
M9 N003 N004 N007 N007 BSB012N03LX3
M10 N007 N005 0 0 BSB012N03LX3
M11 N002 N004 N003 N003 FDC638P
M12 N002 N005 N003 N003 FDC638P
V3 N002 0 15
M13 N010 B N012 N012 BSB012N03LX3
M14 N012 N005 0 0 BSB012N03LX3
M15 N009 B N010 N010 FDC638P
M16 N009 N005 N010 N010 FDC638P
V4 N009 0 15
M17 N015 N004 N017 N017 BSB012N03LX3
M18 N017 A 0 0 BSB012N03LX3
M19 N014 N004 N015 N015 FDC638P
M20 N014 A N015 N015 FDC638P
V5 N014 0 15
M21 N021 B N023 N023 BSB012N03LX3
M22 N023 A 0 0 BSB012N03LX3
M23 N019 B N021 N021 FDC638P
M24 N019 A N021 N021 FDC638P
V6 N019 0 15
M25 Y0 N003 N006 N006 BSB012N03LX3
M26 N006 N003 0 0 BSB012N03LX3
M27 N001 N003 Y0 Y0 FDC638P
M28 N001 N003 Y0 Y0 FDC638P
V7 N001 0 15
M29 Y1 N010 N011 N011 BSB012N03LX3
M30 N011 N010 0 0 BSB012N03LX3
M31 N008 N010 Y1 Y1 FDC638P
M32 N008 N010 Y1 Y1 FDC638P
V8 N008 0 15
M33 Y2 N015 N016 N016 BSB012N03LX3
M34 N016 N015 0 0 BSB012N03LX3
M35 N013 N015 Y2 Y2 FDC638P
M36 N013 N015 Y2 Y2 FDC638P
V9 N013 0 15
M37 Y3 N021 N024 N024 BSB012N03LX3
M38 N024 N021 0 0 BSB012N03LX3
M39 N020 N021 Y3 Y3 FDC638P
M40 N020 N021 Y3 Y3 FDC638P
V10 N020 0 15
.ends decoder_exp5

.model NMOS NMOS
.model PMOS PMOS
.lib standard.mos
.dc V3 list 2 15  V2 list 2 15  V1 list 2 15
.backanno
.end